# EAGLE schematic one_Mhz (EAGLE 7.7.0)
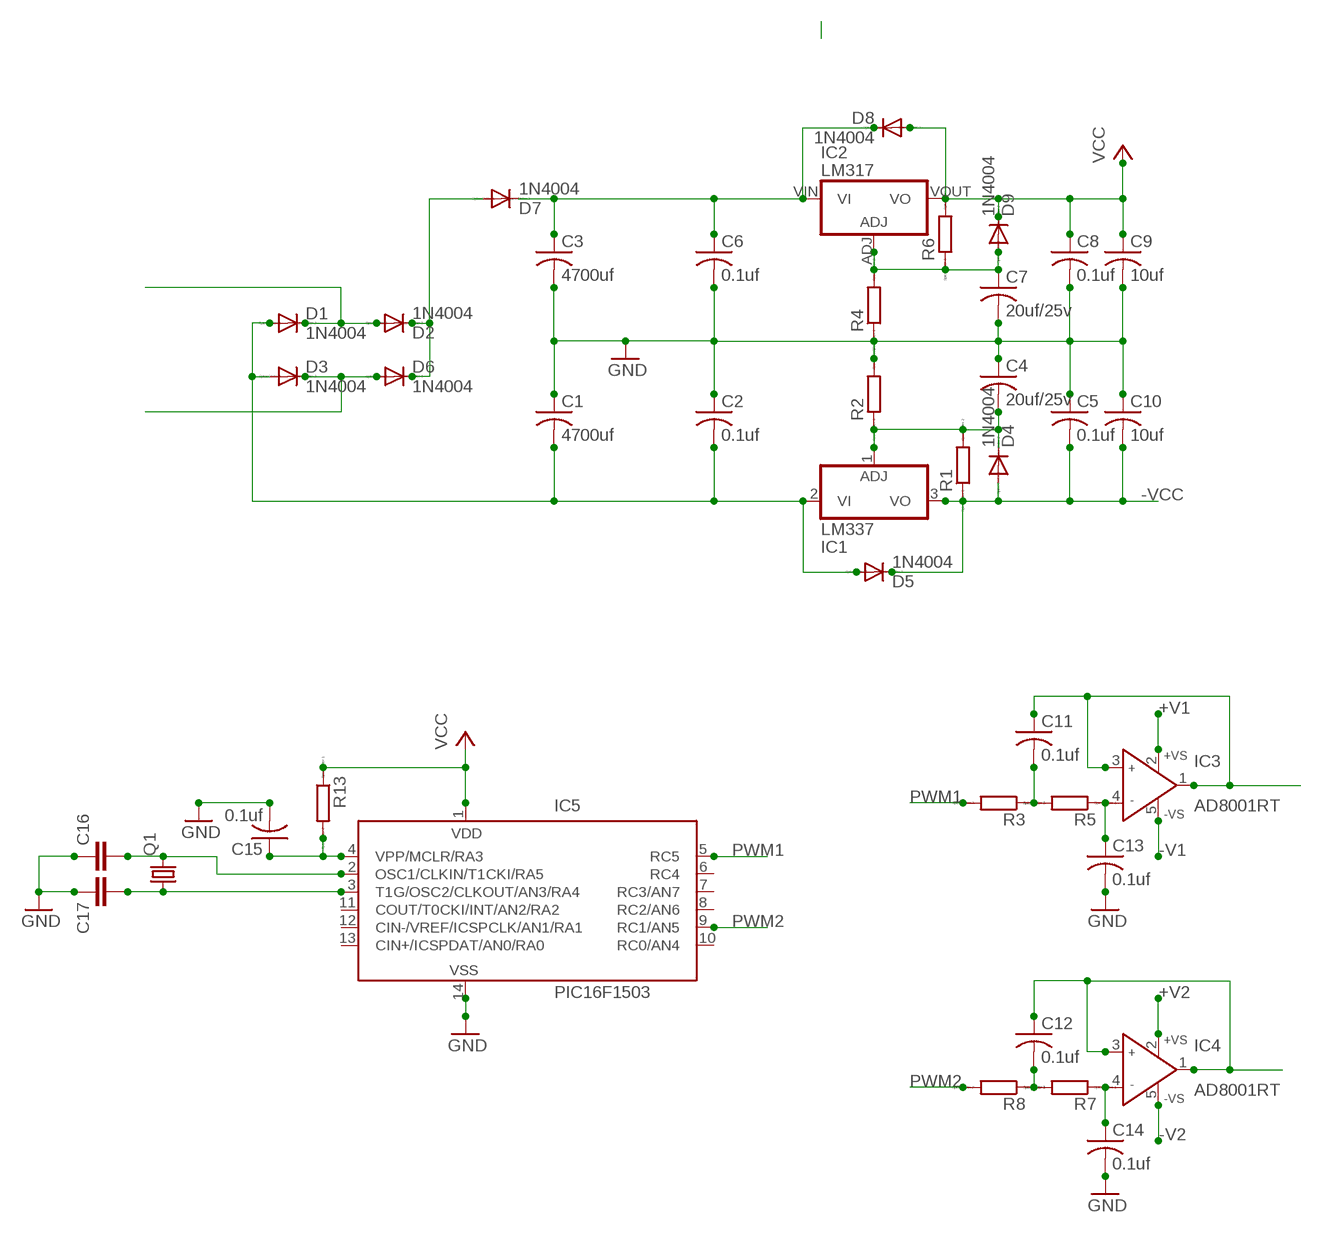
[diagram p0: schematic, sheet 1]

## Parts
C1  4700uf  C-US025-025X050  [C025-025X050]
C2  0.1uf  C-US025-025X050  [C025-025X050]
C3  4700uf  C-US025-025X050  [C025-025X050]
C4  20uf/25v  C-US025-025X050  [C025-025X050]
C5  0.1uf  C-US025-025X050  [C025-025X050]
C6  0.1uf  C-US025-025X050  [C025-025X050]
C7  20uf/25v  C-US025-025X050  [C025-025X050]
C8  0.1uf  C-US025-025X050  [C025-025X050]
C9  10uf  C-US025-025X050  [C025-025X050]
C10  10uf  C-US025-025X050  [C025-025X050]
C11  0.1uf  C-US025-025X050  [C025-025X050]
C12  0.1uf  C-US025-025X050  [C025-025X050]
C13  0.1uf  C-US025-025X050  [C025-025X050]
C14  0.1uf  C-US025-025X050  [C025-025X050]
C15  0.1uf  C-US025-025X050  [C025-025X050]
C16  C2,5-3  [C2.5-3]
C17  C2,5-3  [C2.5-3]
D1  1N4004  [DO41-10]
D2  1N4004  [DO41-10]
D3  1N4004  [DO41-10]
D4  1N4004  [DO41-10]
D5  1N4004  [DO41-10]
D6  1N4004  [DO41-10]
D7  1N4004  [DO41-10]
D8  1N4004  [DO41-10]
D9  1N4004  [DO41-10]
IC1  LM337  788TV  [TO220V]
IC2  LM317  317  [DPACK]
IC3  AD8001RT  [SOT23-5]
IC4  AD8001RT  [SOT23-5]
IC5  PIC16F1503  PIC16F676P  [DIL14]
Q1  CRYSTALHC49U-V  [HC49U-V]
R1  R0207/10  [0207/10]
R2  R0207/10  [0207/10]
R3  R0207/10  [0207/10]
R4  R0207/10  [0207/10]
R5  R0207/10  [0207/10]
R6  R0207/10  [0207/10]
R7  R0207/10  [0207/10]
R8  R0207/10  [0207/10]
R13  R0207/10  [0207/10]

## Nets
+V1: IC3.2(+VS)
+V2: IC4.2(+VS)
-V1: IC3.5(-VS)
-V2: IC4.5(-VS)
-VCC: C5.2 C10.2 D4.A D5.C IC1.3(VO) R1.1
GND: C1.1 C2.1 C3.2 C4.1 C5.1 C6.2 C7.2 C8.2 C9.2 C10.1 C13.2 C14.2 C15.2 C16.1 C17.1 IC5.14(VSS) R2.2 R4.1
N$2: C1.2 C2.2 D1.A D3.A D5.A IC1.2(VI)
N$3: D2.C D6.C D7.A
N$4: D1.C D2.A
N$5: D3.C D6.A
N$6: C3.1 C6.1 D7.C D8.C IC2.VIN(VI)
N$7: C13.1 IC3.4(IN-) R5.1
N$8: C15.1 IC5.4(VPP/MCLR/RA3) R13.2
N$10: C7.1 D9.A IC2.ADJ R4.2 R6.1
N$11: C17.2 IC5.3(T1G/OSC2/CLKOUT/AN3/RA4) Q1.1
N$12: C4.2 D4.C IC1.1(ADJ) R1.2 R2.1
N$13: C14.1 IC4.4(IN-) R7.1
N$14: C12.2 R7.2 R8.1
N$15: C11.2 R3.1 R5.2
N$16: C11.1 IC3.1(OUT) IC3.3(IN+)
N$17: C12.1 IC4.1(OUT) IC4.3(IN+)
N$18: C16.2 IC5.2(OSC1/CLKIN/T1CKI/RA5) Q1.2
PWM1: IC5.5(RC5) R3.2
PWM2: IC5.9(RC1/AN5) R8.2
VCC: C8.1 C9.1 D8.A D9.C IC2.VOUT(VO) IC5.1(VDD) R6.2 R13.1
Unconnected: IC5.6(RC4) IC5.7(RC3/AN7) IC5.8(RC2/AN6) IC5.10(RC0/AN4) IC5.11(COUT/T0CKI/INT/AN2/RA2) IC5.12(CIN-/VREF/ICSPCLK/AN1/RA1) IC5.13(CIN+/ICSPDAT/AN0/RA0)

## Library data of the parts
C1-C15 = rcl:C-US: CAPACITOR, American symbol
C16 C17 = capacitor-wima:C: CAPACITOR naming: grid - package width
D1-D9 = diode:1N4004: DIODE general purpose rectifier, 1 A
IC1 = lm317:78*: Positive VOLTAGE REGULATOR Source: http://cache.national.com/ds/LM/LM78L05.pdf http://www.fairchildsemi.com/ds/LM/LM7805.pdf
IC2 = lm317:*317: Positive VOLTAGE REGULATOR
IC3 IC4 = analog-devices:AD8001: 800 MHz, 50 mW Current Feedback Amplifier Source: http://www.analog.com/static/imported-files/data_sheets/AD8001.pdf; MF: ALTERA CORPORATION; MPN: AD8001ARTZ-REEL7; OC_FARNELL: 1651271; OC_NEWARK: 59K6136
IC5 = microchip:PIC16F676: 14-Pin, Flash-Based 8-Bit CMOS Microcontroller High Performance RISC CPU: * Only 35 instructions to learn - All single-cycle instructions except branches * Operating speed: - DC - 20 MHz oscillator/clock input - DC - 200 ns instruction cycle * Internal and external oscillator options - Precision Internal 4 MHz oscillator factory calibrated to ±1% - External Oscillator support for crystals and resonators - 5?s wake-up from SLEEP, 3.0V, typical * Power saving SLEEP mode * Wide operating voltage range - 2.0V to 5.5V * Industrial and Extended temperature range * Low power Power-on Reset (POR) * Power-up Timer (PWRT) and Oscillator Start-up Timer (OST) * Brown-out Detect (BOD) * Watchdog Timer (WDT) with independent oscillator for reliable operation * Multiplexed MCLR/Input-pin * Interrupt-on-pin change * Individual programmable weak pull-ups * Programmable code protection * High Endurance FLASH/EEPROM Cell - 100,000 write FLASH endurance - 1,000,000 write EEPROM endurance - FLASH/Data EEPROM Retention: > 40 years * Standby Current: - 1 nA @ 2.0V, typical * Operating Current: - 8.5?A @ 32 kHz, 2.0V, typical - 100?A @ 1 MHz, 2.0V, typical * Watchdog Timer Current - 300 nA @ 2.0V, typical * Timer1 oscillator current: - 4?A @ 32 kHz, 2.0V, typical * 12 I/O pins with individual direction control * High current sink/source for direct LED drive * Analog-to-Digital Converter module (PIC16F676): - 10-bit resolution - Programmable 8-channel input - Voltage reference input * In-Circuit Serial ProgrammingTM (ICSPTM) via two pins Source: http://ww1.microchip.com/downloads/en/DeviceDoc/40039E.pdf; MF: MICROCHIP; MPN: PIC16F676-I/P; OC_FARNELL: 9760512; OC_NEWARK: 54K2829
Q1 = crystal:CRYSTAL: CRYSTAL; OC_FARNELL: 1666969; OC_NEWARK: unknown
R1-R8 R13 = eagle-ltspice:R: RESISTOR, European symbol; SPICEMODEL: NONE; SPICEPREFIX: R